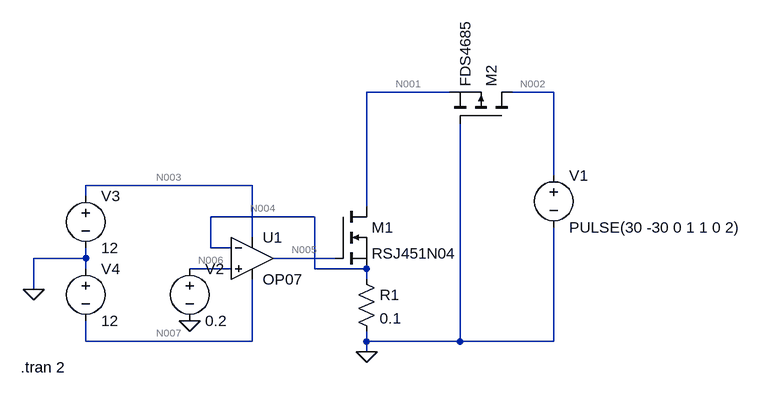
[diagram p0: schematic Draft1.asc]
Draft1.asc, the LTspice schematic file:
Version 4
SHEET 1 880 680
WIRE 432 -80 304 -80
WIRE 592 -80 528 -80
WIRE 592 48 592 -80
WIRE 128 64 -128 64
WIRE -128 80 -128 64
WIRE 304 96 304 -80
WIRE 224 112 64 112
WIRE 128 144 128 64
WIRE 64 160 64 112
WIRE 96 160 64 160
WIRE -128 176 -128 160
WIRE -128 176 -208 176
WIRE 256 176 160 176
WIRE -128 192 -128 176
WIRE 96 192 32 192
WIRE 224 192 224 112
WIRE 304 192 224 192
WIRE 304 208 304 192
WIRE -208 224 -208 176
WIRE -128 304 -128 272
WIRE 128 304 128 208
WIRE 128 304 -128 304
WIRE 304 304 304 288
WIRE 448 304 448 -32
WIRE 448 304 304 304
WIRE 592 304 592 128
WIRE 592 304 448 304
WIRE 304 320 304 304
FLAG 304 320 0
FLAG -208 224 0
FLAG 32 272 0
SYMBOL Opamps\\OP07 128 112 R0
SYMATTR InstName U1
SYMBOL nmos 256 96 R0
SYMATTR InstName M1
SYMATTR Value RSJ451N04
SYMBOL res 288 192 R0
SYMATTR InstName R1
SYMATTR Value 0.1
SYMBOL voltage 592 32 R0
WINDOW 123 0 0 Left 2
WINDOW 39 0 0 Left 2
SYMATTR InstName V1
SYMATTR Value PULSE(30 -30 0 1 1 0 2)
SYMBOL voltage 32 176 R0
WINDOW 123 0 0 Left 2
WINDOW 39 0 0 Left 2
SYMATTR InstName V2
SYMATTR Value 0.2
SYMBOL voltage -128 64 R0
WINDOW 123 0 0 Left 2
WINDOW 39 0 0 Left 2
SYMATTR InstName V3
SYMATTR Value 12
SYMBOL voltage -128 176 R0
WINDOW 123 0 0 Left 2
WINDOW 39 0 0 Left 2
SYMATTR InstName V4
SYMATTR Value 12
SYMBOL pmos 528 -32 M270
SYMATTR InstName M2
SYMATTR Value FDS4685
TEXT -228 344 Left 2 !.tran 2

The netlist it stands for:
* Draft1.asc
XU1 N006 N004 N003 N007 N005 LT1001  ; OP07, pins In+ In- V+ V- OUT
M1 N001 N005 N004 N004 RSJ451N04
R1 N004 0 0.1
V1 N002 0 PULSE(30 -30 0 1 1 0 2)
V2 N006 0 0.2
V3 N003 0 12
V4 0 N007 12
M2 N002 0 N001 N001 FDS4685
.model NMOS NMOS
.model PMOS PMOS
.lib standard.mos
.tran 2
.lib LTC.lib
.backanno
.end

* Results of the author's LTspice run, read from the files saved beside the schematic
* Operating Point, zero values left out:
*   V(n004) = 200 mV
*   V(n006) = 200 mV
*   V(n003) = 12 V
*   V(n007) = -12 V
*   V(n005) = 2.845 V
*   V(n001) = 29.97 V
*   V(n002) = 30 V
*   Id(M2) = 2 A
*   Is(M2) = -2 A
*   Id(M1) = 2 A
*   Is(M1) = -2 A
*   I(R1) = 2 A
*   I(V4) = -2.25 mA
*   I(V3) = -2.25 mA
*   I(V1) = -2 A
*   Ix(u1:3) = 2.25 mA
*   Ix(u1:4) = -2.25 mA
*   Ix(u1:5) = -5.691 pA
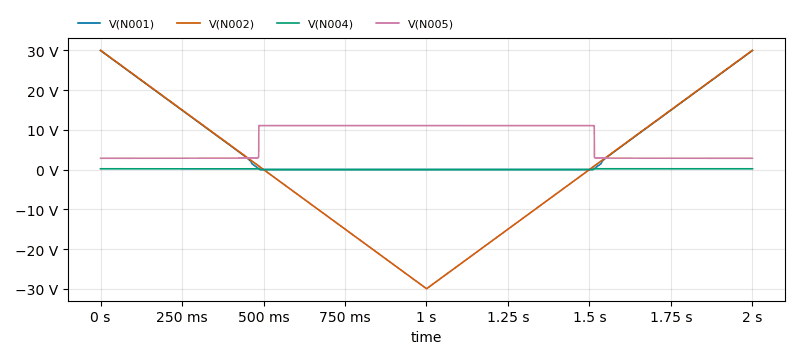
[diagram p1: Transient Analysis of Draft1.asc, plotted from the saved traces]
* Transient Analysis, 1 run:
*   V(N001): min -5.022 µV, max 29.97 V, average 7.46 V, rms 12.75 V, last 29.97 V
*   V(N002): min -30 V, max 30 V, average 0 V, rms 18.08 V, last 30 V
*   V(N004): min -4.933 µV, max 207.8 mV, average 97.57 mV, rms 139.6 mV, last 200 mV
*   V(N005): min 2.845 V, max 11.07 V, average 7.091 V, rms 8.19 V, last 2.845 V